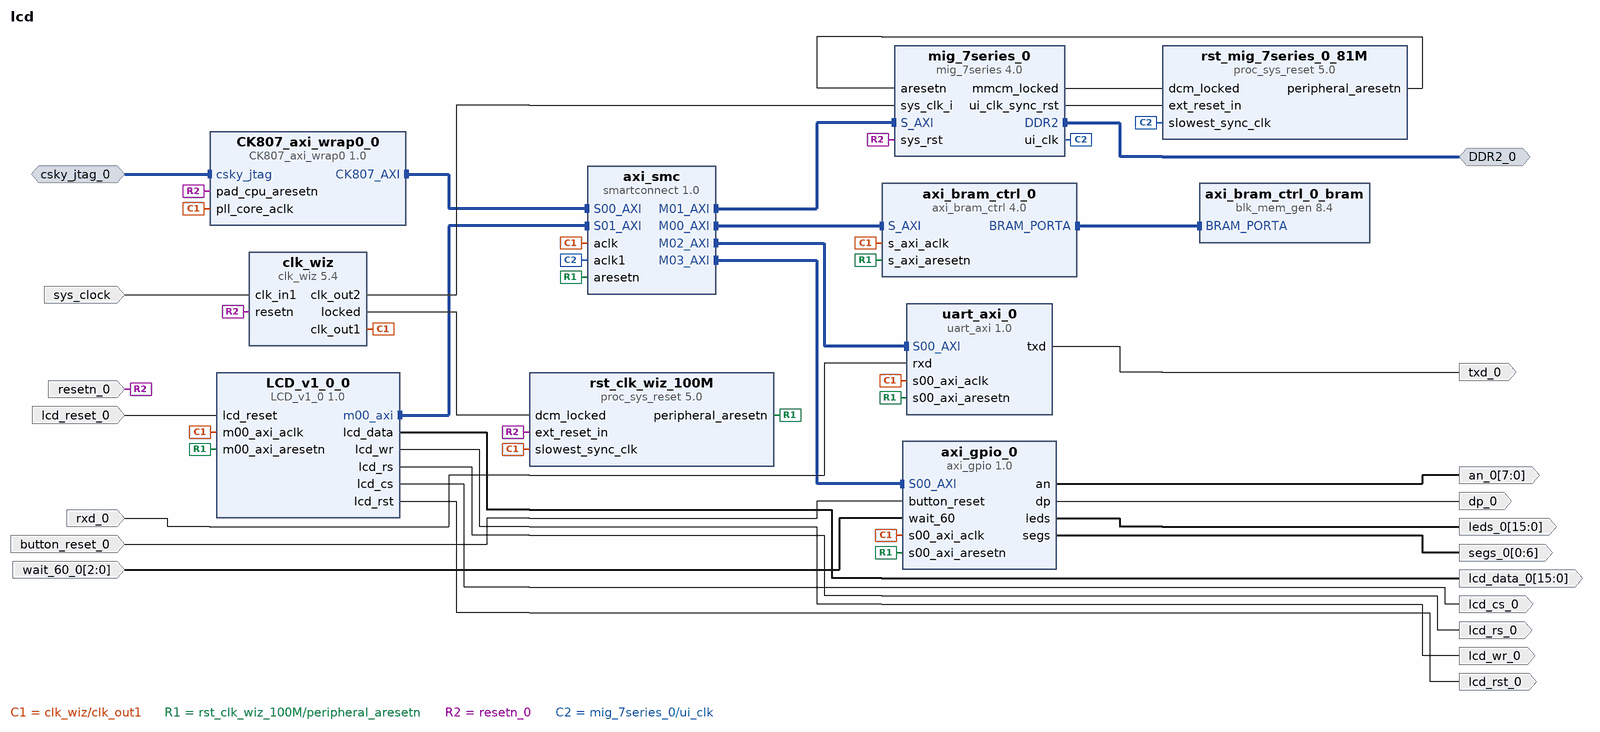
[diagram p0: block diagram of the top level]
# Vivado block design lcd, xc7a100tcsg324-1, Vivado 2017.4
create_bd_design lcd

create_bd_intf_port -mode Slave -vlnv vlsi.zju.edu.cn:user:csky_jtag_rtl:1.0 csky_jtag_0
create_bd_intf_port -mode Master -vlnv xilinx.com:interface:ddrx_rtl:1.0 DDR2_0
create_bd_port -dir I -type clk sys_clock
set_property -dict {CONFIG.FREQ_HZ 100000000 CONFIG.PHASE 0.000} [get_bd_ports sys_clock]
create_bd_port -dir I -type rst resetn_0
create_bd_port -dir I rxd_0
create_bd_port -dir O txd_0
create_bd_port -dir O -from 15 -to 0 leds_0
create_bd_port -dir O -from 7 -to 0 an_0
create_bd_port -dir O -from 0 -to 6 segs_0
create_bd_port -dir I -type rst button_reset_0
set_property -dict {CONFIG.POLARITY ACTIVE_HIGH} [get_bd_ports button_reset_0]
create_bd_port -dir O dp_0
create_bd_port -dir O -from 15 -to 0 lcd_data_0
create_bd_port -dir O lcd_wr_0
create_bd_port -dir I -type rst lcd_reset_0
set_property -dict {CONFIG.POLARITY ACTIVE_HIGH} [get_bd_ports lcd_reset_0]
create_bd_port -dir O lcd_rs_0
create_bd_port -dir O lcd_cs_0
create_bd_port -dir O -type rst lcd_rst_0
create_bd_port -dir I -from 2 -to 0 wait_60_0

create_bd_cell -type ip -vlnv vlsi.zju.edu.cn:C-SKY:CK807_axi_wrap0:1.0 CK807_axi_wrap0_0
create_bd_cell -type ip -vlnv xilinx.com:ip:mig_7series:4.0 mig_7series_0
create_bd_cell -type ip -vlnv xilinx.com:ip:axi_bram_ctrl:4.0 axi_bram_ctrl_0
set_property -dict {CONFIG.SINGLE_PORT_BRAM 1} [get_bd_cells axi_bram_ctrl_0]
create_bd_cell -type ip -vlnv xilinx.com:ip:smartconnect:1.0 axi_smc
set_property -dict {CONFIG.NUM_MI 4 CONFIG.NUM_SI 3 CONFIG.NUM_CLKS 2} [get_bd_cells axi_smc]
create_bd_cell -type ip -vlnv xilinx.com:ip:clk_wiz:5.4 clk_wiz
set_property -dict [list \
  CONFIG.CLKOUT2_USED true \
  CONFIG.NUM_OUT_CLKS 2 \
  CONFIG.CLKOUT2_REQUESTED_OUT_FREQ 200.000 \
  CONFIG.RESET_PORT resetn \
  CONFIG.MMCM_DIVCLK_DIVIDE 1 \
  CONFIG.MMCM_CLKOUT1_DIVIDE 5 \
  CONFIG.RESET_TYPE ACTIVE_LOW \
  CONFIG.USE_BOARD_FLOW true \
  CONFIG.CLK_IN1_BOARD_INTERFACE sys_clock \
  CONFIG.RESET_BOARD_INTERFACE reset \
  CONFIG.CLKOUT2_JITTER 114.829 \
  CONFIG.CLKOUT2_PHASE_ERROR 98.575 \
] [get_bd_cells clk_wiz]
create_bd_cell -type ip -vlnv xilinx.com:ip:proc_sys_reset:5.0 rst_clk_wiz_100M
set_property -dict {CONFIG.USE_BOARD_FLOW true CONFIG.RESET_BOARD_INTERFACE reset} [get_bd_cells rst_clk_wiz_100M]
create_bd_cell -type ip -vlnv xilinx.com:ip:blk_mem_gen:8.4 axi_bram_ctrl_0_bram
create_bd_cell -type ip -vlnv xilinx.com:ip:proc_sys_reset:5.0 rst_mig_7series_0_81M
create_bd_cell -type ip -vlnv xilinx.com:user:uart_axi:1.0 uart_axi_0
create_bd_cell -type ip -vlnv xilinx.com:user:LCD_v1_0:1.0 LCD_v1_0_0
create_bd_cell -type ip -vlnv xilinx.com:user:axi_gpio:1.0 axi_gpio_0

# ---- connections ----

connect_bd_intf_net [get_bd_intf_pins axi_smc/M00_AXI] [get_bd_intf_pins axi_bram_ctrl_0/S_AXI]
connect_bd_intf_net [get_bd_intf_pins axi_bram_ctrl_0_bram/BRAM_PORTA] [get_bd_intf_pins axi_bram_ctrl_0/BRAM_PORTA]
connect_bd_intf_net [get_bd_intf_pins CK807_axi_wrap0_0/CK807_AXI] [get_bd_intf_pins axi_smc/S00_AXI]
connect_bd_intf_net [get_bd_intf_pins axi_smc/M01_AXI] [get_bd_intf_pins mig_7series_0/S_AXI]
connect_bd_intf_net [get_bd_intf_pins axi_smc/M02_AXI] [get_bd_intf_pins uart_axi_0/S00_AXI]
connect_bd_intf_net [get_bd_intf_pins axi_smc/M03_AXI] [get_bd_intf_pins axi_gpio_0/S00_AXI]
connect_bd_intf_net [get_bd_intf_pins LCD_v1_0_0/m00_axi] [get_bd_intf_pins axi_smc/S01_AXI]
connect_bd_intf_net -intf_net csky_jtag_0_1 [get_bd_intf_ports csky_jtag_0] [get_bd_intf_pins CK807_axi_wrap0_0/csky_jtag]
connect_bd_intf_net [get_bd_intf_ports DDR2_0] [get_bd_intf_pins mig_7series_0/DDR2]
connect_bd_net [get_bd_pins clk_wiz/clk_out1] \
  [get_bd_pins axi_smc/aclk] [get_bd_pins rst_clk_wiz_100M/slowest_sync_clk] [get_bd_pins axi_bram_ctrl_0/s_axi_aclk] \
  [get_bd_pins CK807_axi_wrap0_0/pll_core_aclk] [get_bd_pins uart_axi_0/s00_axi_aclk] [get_bd_pins LCD_v1_0_0/m00_axi_aclk] \
  [get_bd_pins axi_gpio_0/s00_axi_aclk]
connect_bd_net [get_bd_pins clk_wiz/locked] [get_bd_pins rst_clk_wiz_100M/dcm_locked]
connect_bd_net [get_bd_pins rst_clk_wiz_100M/peripheral_aresetn] \
  [get_bd_pins axi_bram_ctrl_0/s_axi_aresetn] [get_bd_pins axi_smc/aresetn] [get_bd_pins uart_axi_0/s00_axi_aresetn] \
  [get_bd_pins LCD_v1_0_0/m00_axi_aresetn] [get_bd_pins axi_gpio_0/s00_axi_aresetn]
connect_bd_net [get_bd_ports sys_clock] [get_bd_pins clk_wiz/clk_in1]
connect_bd_net -net resetn_0_1 [get_bd_ports resetn_0] \
  [get_bd_pins clk_wiz/resetn] [get_bd_pins rst_clk_wiz_100M/ext_reset_in] [get_bd_pins CK807_axi_wrap0_0/pad_cpu_aresetn] \
  [get_bd_pins mig_7series_0/sys_rst]
connect_bd_net [get_bd_pins mig_7series_0/ui_clk] [get_bd_pins axi_smc/aclk1] [get_bd_pins rst_mig_7series_0_81M/slowest_sync_clk]
connect_bd_net [get_bd_pins mig_7series_0/mmcm_locked] [get_bd_pins rst_mig_7series_0_81M/dcm_locked]
connect_bd_net [get_bd_pins mig_7series_0/ui_clk_sync_rst] [get_bd_pins rst_mig_7series_0_81M/ext_reset_in]
connect_bd_net [get_bd_pins rst_mig_7series_0_81M/peripheral_aresetn] [get_bd_pins mig_7series_0/aresetn]
connect_bd_net [get_bd_pins clk_wiz/clk_out2] [get_bd_pins mig_7series_0/sys_clk_i]
connect_bd_net -net rxd_0_1 [get_bd_ports rxd_0] [get_bd_pins uart_axi_0/rxd]
connect_bd_net [get_bd_pins uart_axi_0/txd] [get_bd_ports txd_0]
connect_bd_net [get_bd_pins axi_gpio_0/leds] [get_bd_ports leds_0]
connect_bd_net [get_bd_pins axi_gpio_0/an] [get_bd_ports an_0]
connect_bd_net [get_bd_pins axi_gpio_0/segs] [get_bd_ports segs_0]
connect_bd_net -net button_reset_0_1 [get_bd_ports button_reset_0] [get_bd_pins axi_gpio_0/button_reset]
connect_bd_net [get_bd_pins axi_gpio_0/dp] [get_bd_ports dp_0]
connect_bd_net [get_bd_pins LCD_v1_0_0/lcd_data] [get_bd_ports lcd_data_0]
connect_bd_net [get_bd_pins LCD_v1_0_0/lcd_wr] [get_bd_ports lcd_wr_0]
connect_bd_net -net lcd_reset_0_1 [get_bd_ports lcd_reset_0] [get_bd_pins LCD_v1_0_0/lcd_reset]
connect_bd_net [get_bd_pins LCD_v1_0_0/lcd_rs] [get_bd_ports lcd_rs_0]
connect_bd_net [get_bd_pins LCD_v1_0_0/lcd_cs] [get_bd_ports lcd_cs_0]
connect_bd_net [get_bd_pins LCD_v1_0_0/lcd_rst] [get_bd_ports lcd_rst_0]
connect_bd_net -net wait_60_0_1 [get_bd_ports wait_60_0] [get_bd_pins axi_gpio_0/wait_60]

# ---- address map ----
assign_bd_address -offset 0x40000000 -range 64K -target_address_space [get_bd_addr_spaces CK807_axi_wrap0_0/CK807_AXI] [get_bd_addr_segs axi_gpio_0/S00_AXI/S00_AXI_reg]
assign_bd_address -offset 0x40600000 -range 64K -target_address_space [get_bd_addr_spaces CK807_axi_wrap0_0/CK807_AXI] [get_bd_addr_segs uart_axi_0/S00_AXI/S00_AXI_reg]
assign_bd_address -offset 0x80000000 -range 128M -target_address_space [get_bd_addr_spaces CK807_axi_wrap0_0/CK807_AXI] [get_bd_addr_segs mig_7series_0/memmap/memaddr]
assign_bd_address -offset 0xC0000000 -range 8K -target_address_space [get_bd_addr_spaces CK807_axi_wrap0_0/CK807_AXI] [get_bd_addr_segs axi_bram_ctrl_0/S_AXI/Mem0]
assign_bd_address -offset 0x40000000 -range 64K -target_address_space [get_bd_addr_spaces LCD_v1_0_0/m00_axi] [get_bd_addr_segs axi_gpio_0/S00_AXI/S00_AXI_reg]
assign_bd_address -offset 0x40600000 -range 64K -target_address_space [get_bd_addr_spaces LCD_v1_0_0/m00_axi] [get_bd_addr_segs uart_axi_0/S00_AXI/S00_AXI_reg]
assign_bd_address -offset 0x80000000 -range 128M -target_address_space [get_bd_addr_spaces LCD_v1_0_0/m00_axi] [get_bd_addr_segs mig_7series_0/memmap/memaddr]
assign_bd_address -offset 0xC0000000 -range 8K -target_address_space [get_bd_addr_spaces LCD_v1_0_0/m00_axi] [get_bd_addr_segs axi_bram_ctrl_0/S_AXI/Mem0]

validate_bd_design
save_bd_design
